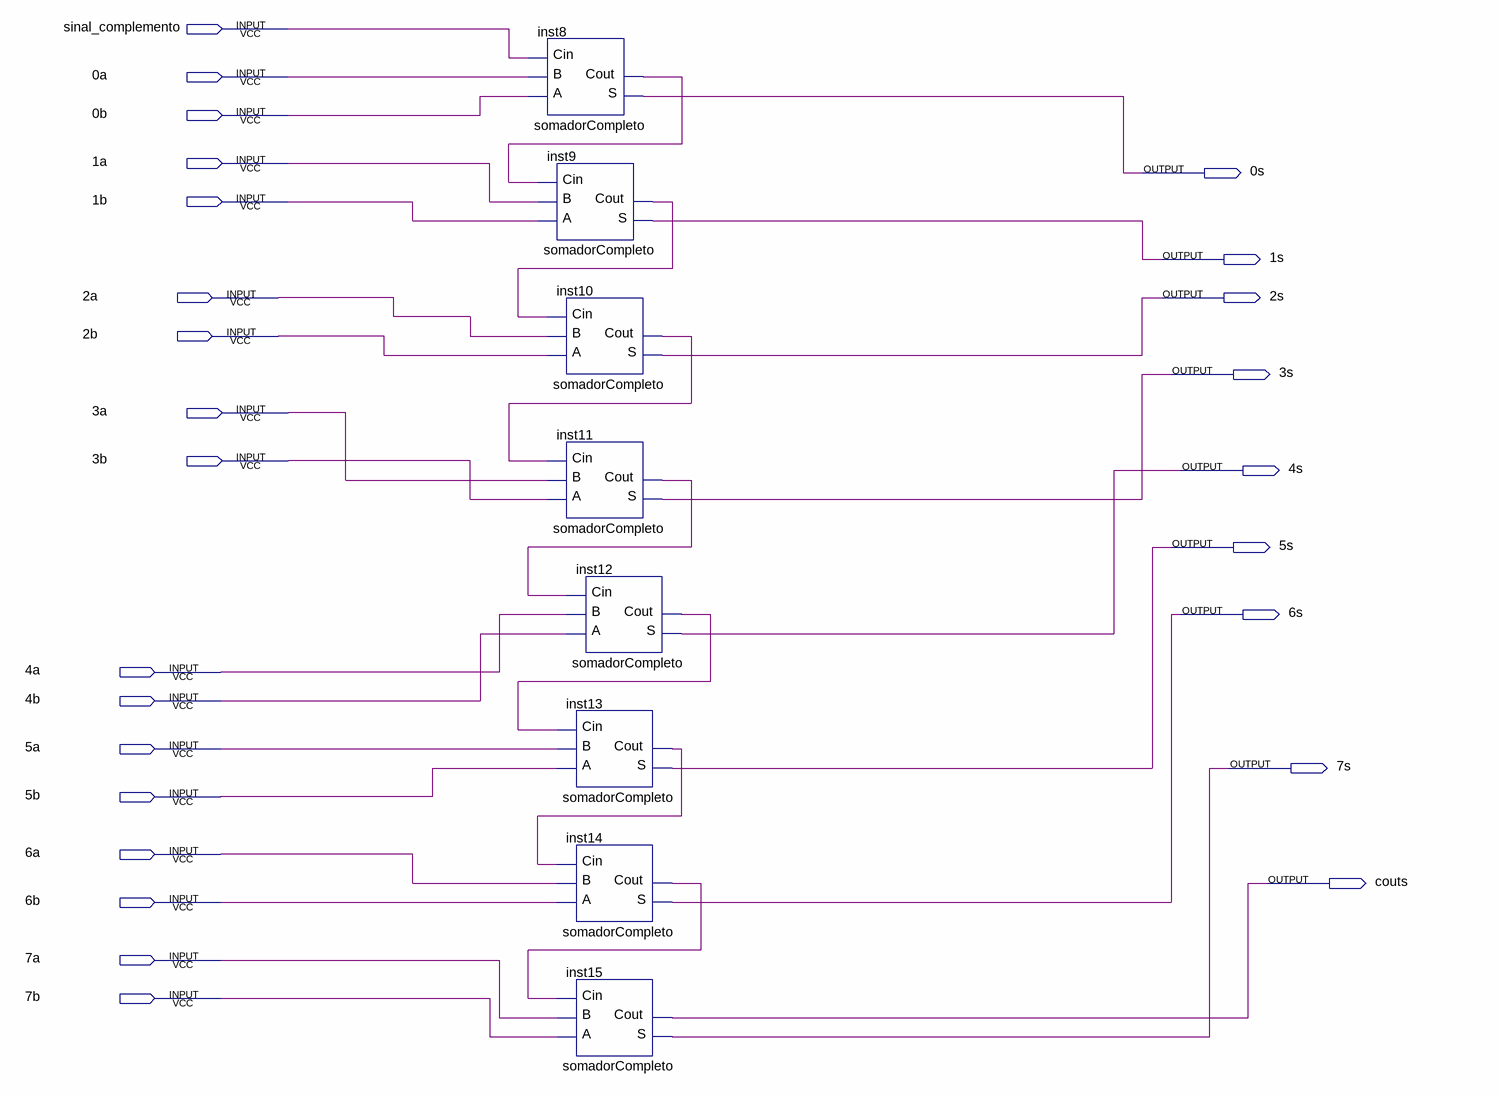
[diagram p0: schematic sheet]
// Quartus schematic somador4BitsDobrado.bdf as structural Verilog: 8 symbols, 26 pins
module somador4BitsDobrado (
  input  sinal_complemento,
  input  \0a ,
  input  \0b ,
  input  \1a ,
  input  \1b ,
  input  \2a ,
  input  \2b ,
  input  \3a ,
  input  \3b ,
  input  \4a ,
  input  \4b ,
  input  \5a ,
  input  \5b ,
  input  \6a ,
  input  \6b ,
  input  \7a ,
  input  \7b ,
  output \0s ,
  output \1s ,
  output \2s ,
  output \3s ,
  output \4s ,
  output \5s ,
  output \6s ,
  output \7s ,
  output couts
);

  wire inst8_cout, inst9_cout, inst10_cout, inst11_cout, inst12_cout, inst13_cout, inst14_cout;

  somadorCompleto inst8 (.A(\0b ), .B(\0a ), .Cin(sinal_complemento), .S(\0s ), .Cout(inst8_cout));
  somadorCompleto inst9 (.A(\1b ), .B(\1a ), .Cin(inst8_cout), .S(\1s ), .Cout(inst9_cout));
  somadorCompleto inst10 (.A(\2b ), .B(\2a ), .Cin(inst9_cout), .S(\2s ), .Cout(inst10_cout));
  somadorCompleto inst11 (.A(\3b ), .B(\3a ), .Cin(inst10_cout), .S(\3s ), .Cout(inst11_cout));
  somadorCompleto inst13 (.A(\5b ), .B(\5a ), .Cin(inst12_cout), .S(\5s ), .Cout(inst13_cout));
  somadorCompleto inst14 (.A(\6b ), .B(\6a ), .Cin(inst13_cout), .S(\6s ), .Cout(inst14_cout));
  somadorCompleto inst15 (.A(\7b ), .B(\7a ), .Cin(inst14_cout), .S(\7s ), .Cout(couts));
  somadorCompleto inst12 (.A(\4b ), .B(\4a ), .Cin(inst11_cout), .S(\4s ), .Cout(inst12_cout));
endmodule
